# EAGLE design EddieBoardA1 (EAGLE 7.0.0)
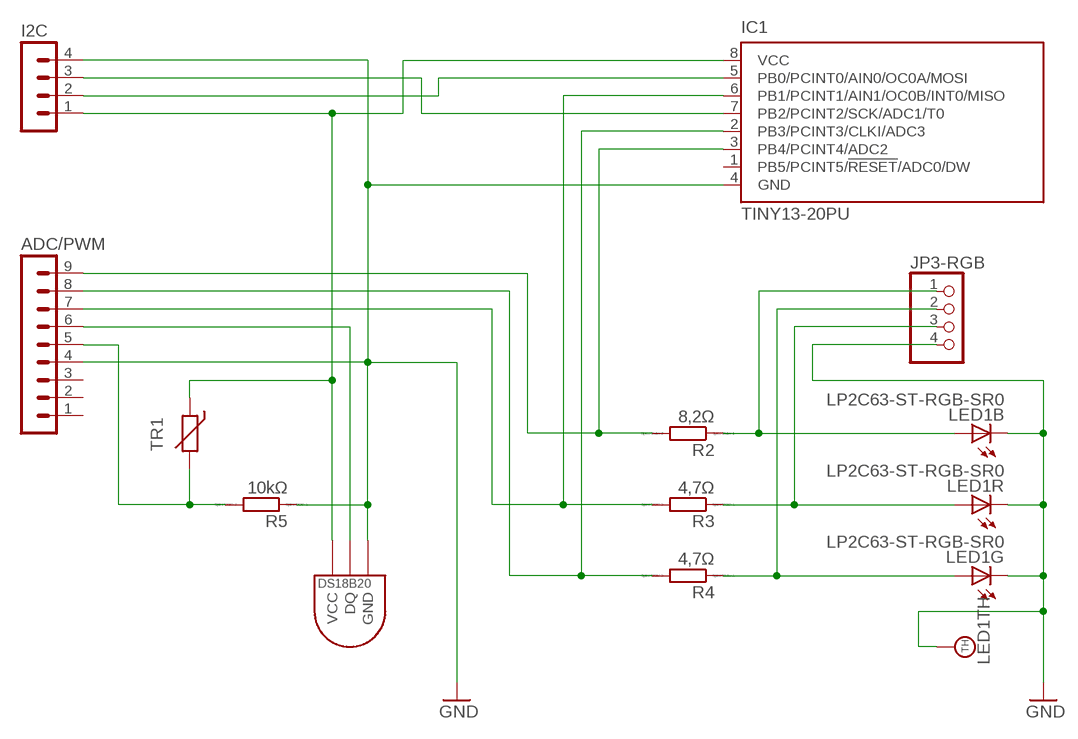
[diagram p0: schematic, sheet 1]

## Parts
ADC/PWM  MA09-1  [MA09-1]
I2C  MA04-1  [MA04-1]
IC1  TINY13-20PU  [DIL08]
JP3-RGB  PINHD-1X4  [1X04]
LED1  LP2C63-ST-RGB-SR0  [LP2C63-ST-RGB-SR0]
R2  8,2Ω  R0204/7  [0204/7]
R3  4,7Ω  R0204/7  [0204/7]
R4  4,7Ω  R0204/7  [0204/7]
R5  10kΩ  R0204/7  [0204/7]
TR1  THERMISTOR_R-5  [R-5]
U$1  DS1820TO92  [DS1820]

## Nets
GND: ADC/PWM.4 I2C.4 IC1.4(GND) JP3-RGB.4 LED1.4(B:C) LED1.5(R:C) LED1.6(G:C) LED1.TH(TH:TH) R5.1 U$1.GND
N$1: ADC/PWM.6 U$1.DQ
N$2: ADC/PWM.7 IC1.6(PB1/PCINT1/AIN1/OC0B/INT0/MISO) R3.2
N$3: ADC/PWM.8 IC1.2(PB3/PCINT3/CLKI/ADC3) R4.2
N$4: ADC/PWM.9 IC1.3(PB4/PCINT4/ADC2) R2.2
N$5: JP3-RGB.1 LED1.3(B:A) R2.1
N$6: JP3-RGB.3 LED1.2(R:A) R3.1
N$7: JP3-RGB.2 LED1.1(G:A) R4.1
N$8: ADC/PWM.5 R5.2 TR1.2
SCL: I2C.3 IC1.7(PB2/PCINT2/SCK/ADC1/T0)
SDA: I2C.2 IC1.5(PB0/PCINT0/AIN0/OC0A/MOSI)
VCC: I2C.1 IC1.8(VCC) TR1.1 U$1.VDD(VCC)
Unconnected: ADC/PWM.1 ADC/PWM.2 ADC/PWM.3 IC1.1(PB5/PCINT5/!RESET!/ADC0/DW)

## Library data of the parts
ADC/PWM = con-lstb:MA09-1: PIN HEADER; OC_FARNELL: unknown; OC_NEWARK: unknown
I2C = con-lstb:MA04-1: PIN HEADER; OC_FARNELL: unknown; OC_NEWARK: unknown
IC1 = atmel:TINY13: 8-bit AVR Microcontroller with 1K Bytes In-System Programmable Flash Source: http://www.atmel.com/dyn/resources/prod_documents/2535S.pdf; MPN: ATTINY13-20PU; OC_FARNELL: 9171550; OC_NEWARK: 96K6521
JP3-RGB = pinhead:PINHD-1X4: PIN HEADER
LED1 = led_Mod:LP2C63-ST-RGB-SR0: 1.5W RGB HIGH POWER LED Source: http://www.ledtech.com.tw .. LP2C63-ST-RGB-SR0.SPEC.pdf
R2-R5 = eagle-ltspice:R: RESISTOR, European symbol; SPICEMODEL: NONE; SPICEPREFIX: R
TR1 = discrete:THERMISTOR_: Thermo Resistor
U$1 = Ava:DS1820: DS18B20 Programmable Resolution 1-Wire Digital Thermometer Description The DS18B20 digital thermometer provides 9-bit to 12-bit Celsius temperature measurements and has an alarm function with nonvolatile user-programmable upper and lower trigger points. The DS18B20 communicates over a 1-Wire® bus that by definition requires only one data line (and ground) for communication with a central microprocessor. It has an operating temperature range of -55°C to +125°C and is accurate to ±0.5°C over the range of -10°C to +85°C. In addition, the DS18B20 can derive power directly from the data line ("parasite power"), eliminating the need for an external power supply. Each DS18B20 has a unique 64-bit serial code, which allows multiple DS18B20s to function on the same 1-Wire bus. Thus, it is simple to use one microprocessor to control many DS18B20s distributed over a large area. Applications that can benefit from this feature include HVAC environmental controls, temperature monitoring systems inside buildings, equipment, or machinery, and process monitoring and control systems.

## Board
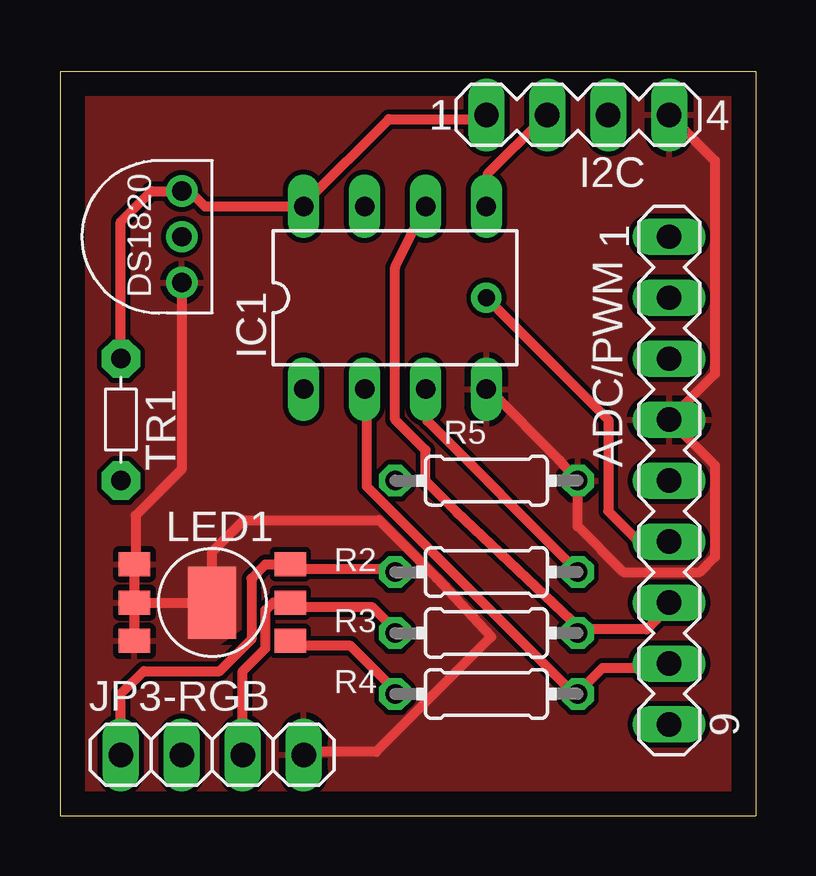
[diagram p1: board, top side]
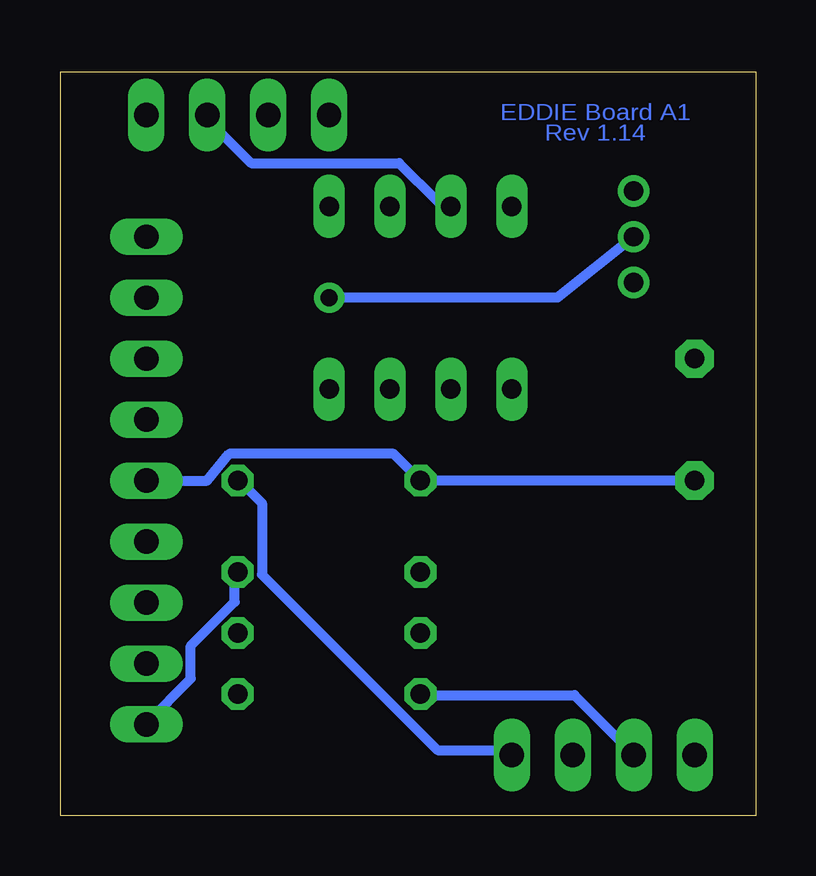
[diagram p2: board, bottom side, seen from below]

Size 29 x 31 mm. Coordinates in mm from the lower left corner, seen from the top.
Outline: 0,0 29,0 29,31 0,31 0,0
Copper layers (1*16): Top 0.035mm / dielectric 1.5mm / Bottom 0.035mm
Design rules "default": minimum track width 10mil, minimum drill 24mil, track to track 8mil, track to pad 8mil, pad to pad 8mil, via to via 8mil, smd to smd 8mil, copper to edge 40mil, drill to drill 8mil, minimum pad ring 10mil, minimum via ring 8mil, stop-mask expansion 4mil, vias tented up to drill 0mil, thermal gap 10mil

### Footprints (pad centres in the part's own frame; a part is rotated, then mirrored left to right if it is on the bottom)
MA09-1 = drill 1.016 long: 1 -10.16,0; 2 -7.62,0; 3 -5.08,0; 4 -2.54,0; 5 0,0; 6 2.54,0; 7 5.08,0; 8 7.62,0; 9 10.16,0
MA04-1 = drill 1.016 long: 1 -3.81,0; 2 -1.27,0; 3 1.27,0; 4 3.81,0
DIL08 = drill 0.813 long: 1 -3.81,-3.81; 2 -1.27,-3.81; 3 1.27,-3.81; 4 3.81,-3.81; 5 3.81,3.81; 6 1.27,3.81; 7 -1.27,3.81; 8 -3.81,3.81
1X04 = drill 1.016 long: 1 -3.81,0; 2 -1.27,0; 3 1.27,0; 4 3.81,0
LP2C63-ST-RGB-SR0 = smd 1.3 x 1: 1 -3.25,1.6; 2 -3.25,0; 3 -3.25,-1.6; 4 3.25,-1.6; 5 3.25,0; 6 3.25,1.6 | smd 2 x 3: TH 0,0
0204/7 = drill 0.813 octagon: 1 -3.81,0; 2 3.81,0
R-5 = drill 0.813 pad 1.6 octagon: 1 -2.54,0; 2 2.54,0
DS1820 = drill 0.8: DQ 2.54,-1.27; GND 0.635,-1.27; VDD 4.445,-1.27

### Placement (x,y rotation side)
ADC/PWM  25.4,13.97 270 top
I2C  21.59,29.21 0 top
IC1  13.97,21.59 0 top
JP3-RGB  6.35,2.54 0 top
LED1  6.35,8.89 180 top
R2  17.78,10.16 0 top
R3  17.78,7.62 0 top
R4  17.78,5.08 0 top
R5  17.78,13.97 180 top
TR1  2.54,16.51 270 top
U$1  3.81,21.59 90 top

### Tracks (layer width: path | path; a pad name or v marks a point on that pad's centre or on a via)
GND
  Top 0.254: 3.2,7.32 LED1.6
  Top 0.406: 17.6,17.83 IC1.4 17.83,17.83 20.85,14.81 R5.1 21.59,12.06 23.5,10.16 26.67,10.16 27.3,10.79 27.3,14.61 ADC/PWM.4 27.3,18.41 27.3,27.3 I2C.4 | U$1.GND 5.08,14.45 3.15,12.52 3.15,10.54 LED1.4 LED1.5 | LED1.5 LED1.6 | LED1.5 LED1.TH 6.35,11.01 7.67,12.32 13.3,12.32 15.71,9.89 17.97,7.46 13.18,2.66 10.6,2.66 JP3-RGB.4
  Bottom 0.406: JP3-RGB.4 10.6,2.74 13.26,2.74 20.57,10.06 20.57,13.03 21.49,13.95 R5.1
  pour Top (no thermals): 5.08,10.79 5.07,7.23 6.5,7.23 7.47,7.93 7.47,10.79
  pour Top: 0,0 29,0 29,31 0,31
N$1  (via drill 0.7 pad 1.27)
  Top 0.406: v17.78,21.59 22.86,16.51 22.86,12.7 24.13,11.43 ADC/PWM.6
  Bottom 0.406: U$1.DQ 8.26,21.59 v17.78,21.59
N$2
  Top 0.406: 21.72,7.77 24.46,7.77 25.38,8.69 ADC/PWM.7 | 21.72,7.77 R3.2 | 21.72,7.77 16.51,12.7 15.24,13.97 15.24,15.24 13.97,16.51 13.97,22.86 IC1.6
N$3
  Top 0.254: 21.49,5.03 R4.2 | 25.38,6.17 ADC/PWM.8
  Top 0.406: 21.49,5.03 12.8,13.72 12.8,17.6 IC1.2 | 25.38,6.17 22.63,6.17 21.72,5.26 R4.2
N$4
  Top 0.406: IC1.3 15.32,17.6 15.32,16.46 21.49,10.29 R2.2
  Bottom 0.254: 25.38,3.89 ADC/PWM.9
  Bottom 0.406: 25.38,3.89 23.55,5.71 23.55,7.09 21.72,8.91 21.72,10.06 R2.2
N$5
  Top 0.254: 9.6,10.29 LED1.3 9.37,10.29
  Top 0.406: 9.6,10.29 13.95,10.29 R2.1 | JP3-RGB.1 2.54,5.08 3.49,6.03 6.66,6.03 7.98,7.36 7.98,9.89 8.57,10.48 9.59,10.48 LED1.3
N$6
  Top 0.254: 9.6,8.69 LED1.2
  Top 0.406: 9.6,8.69 13.03,8.69 13.95,7.77 R3.1 | JP3-RGB.3 7.62,6.03 8.57,6.99 8.57,8.57 8.89,8.89 LED1.2
N$7
  Top 0.254: 9.6,7.09 LED1.1
  Top 0.406: 9.6,7.09 12.12,7.09 13.95,5.26 R4.1
  Bottom 0.254: 13.95,5.03 R4.1
  Bottom 0.406: 13.95,5.03 7.54,5.03 5.26,2.74 JP3-RGB.2
N$8
  Bottom 0.406: TR1.2 R5.2 15.09,15.09 21.95,15.09 22.86,13.97 ADC/PWM.5
N$9
  cutout Bottom: 2.22,27.94 11.11,27.94 11.11,29.84 2.22,29.84
SCL
  Bottom 0.406: IC1.7 12.8,25.6 13.26,25.6 14.86,27.2 21.03,27.2 22.86,29.03 I2C.3
SDA
  Top 0.406: IC1.5 17.83,25.6 17.83,26.75 20.12,29.03 I2C.2
VCC
  Top 0.406: I2C.1 17.6,29.03 13.72,29.03 10.29,25.6 IC1.8 6.03,25.4 5.4,26.04 U$1.VDD 3.81,26.04 2.54,24.77 TR1.1

### Text on the board
Bottom: EDDIE Board A1 / Rev 1.14
bStop: EDDIE Board A1 / Rev 1.14